# Altium schematic sheet pa.SchDoc: mcHF Pro Transceiver RF board
size A3; Author: Krassi Atanassov; CompanyName: MØNKA; Engineer: For radio amateurs experimentation, non-commercial use only. Thank you!; Revision: 0.8.2; SheetTotal: 14
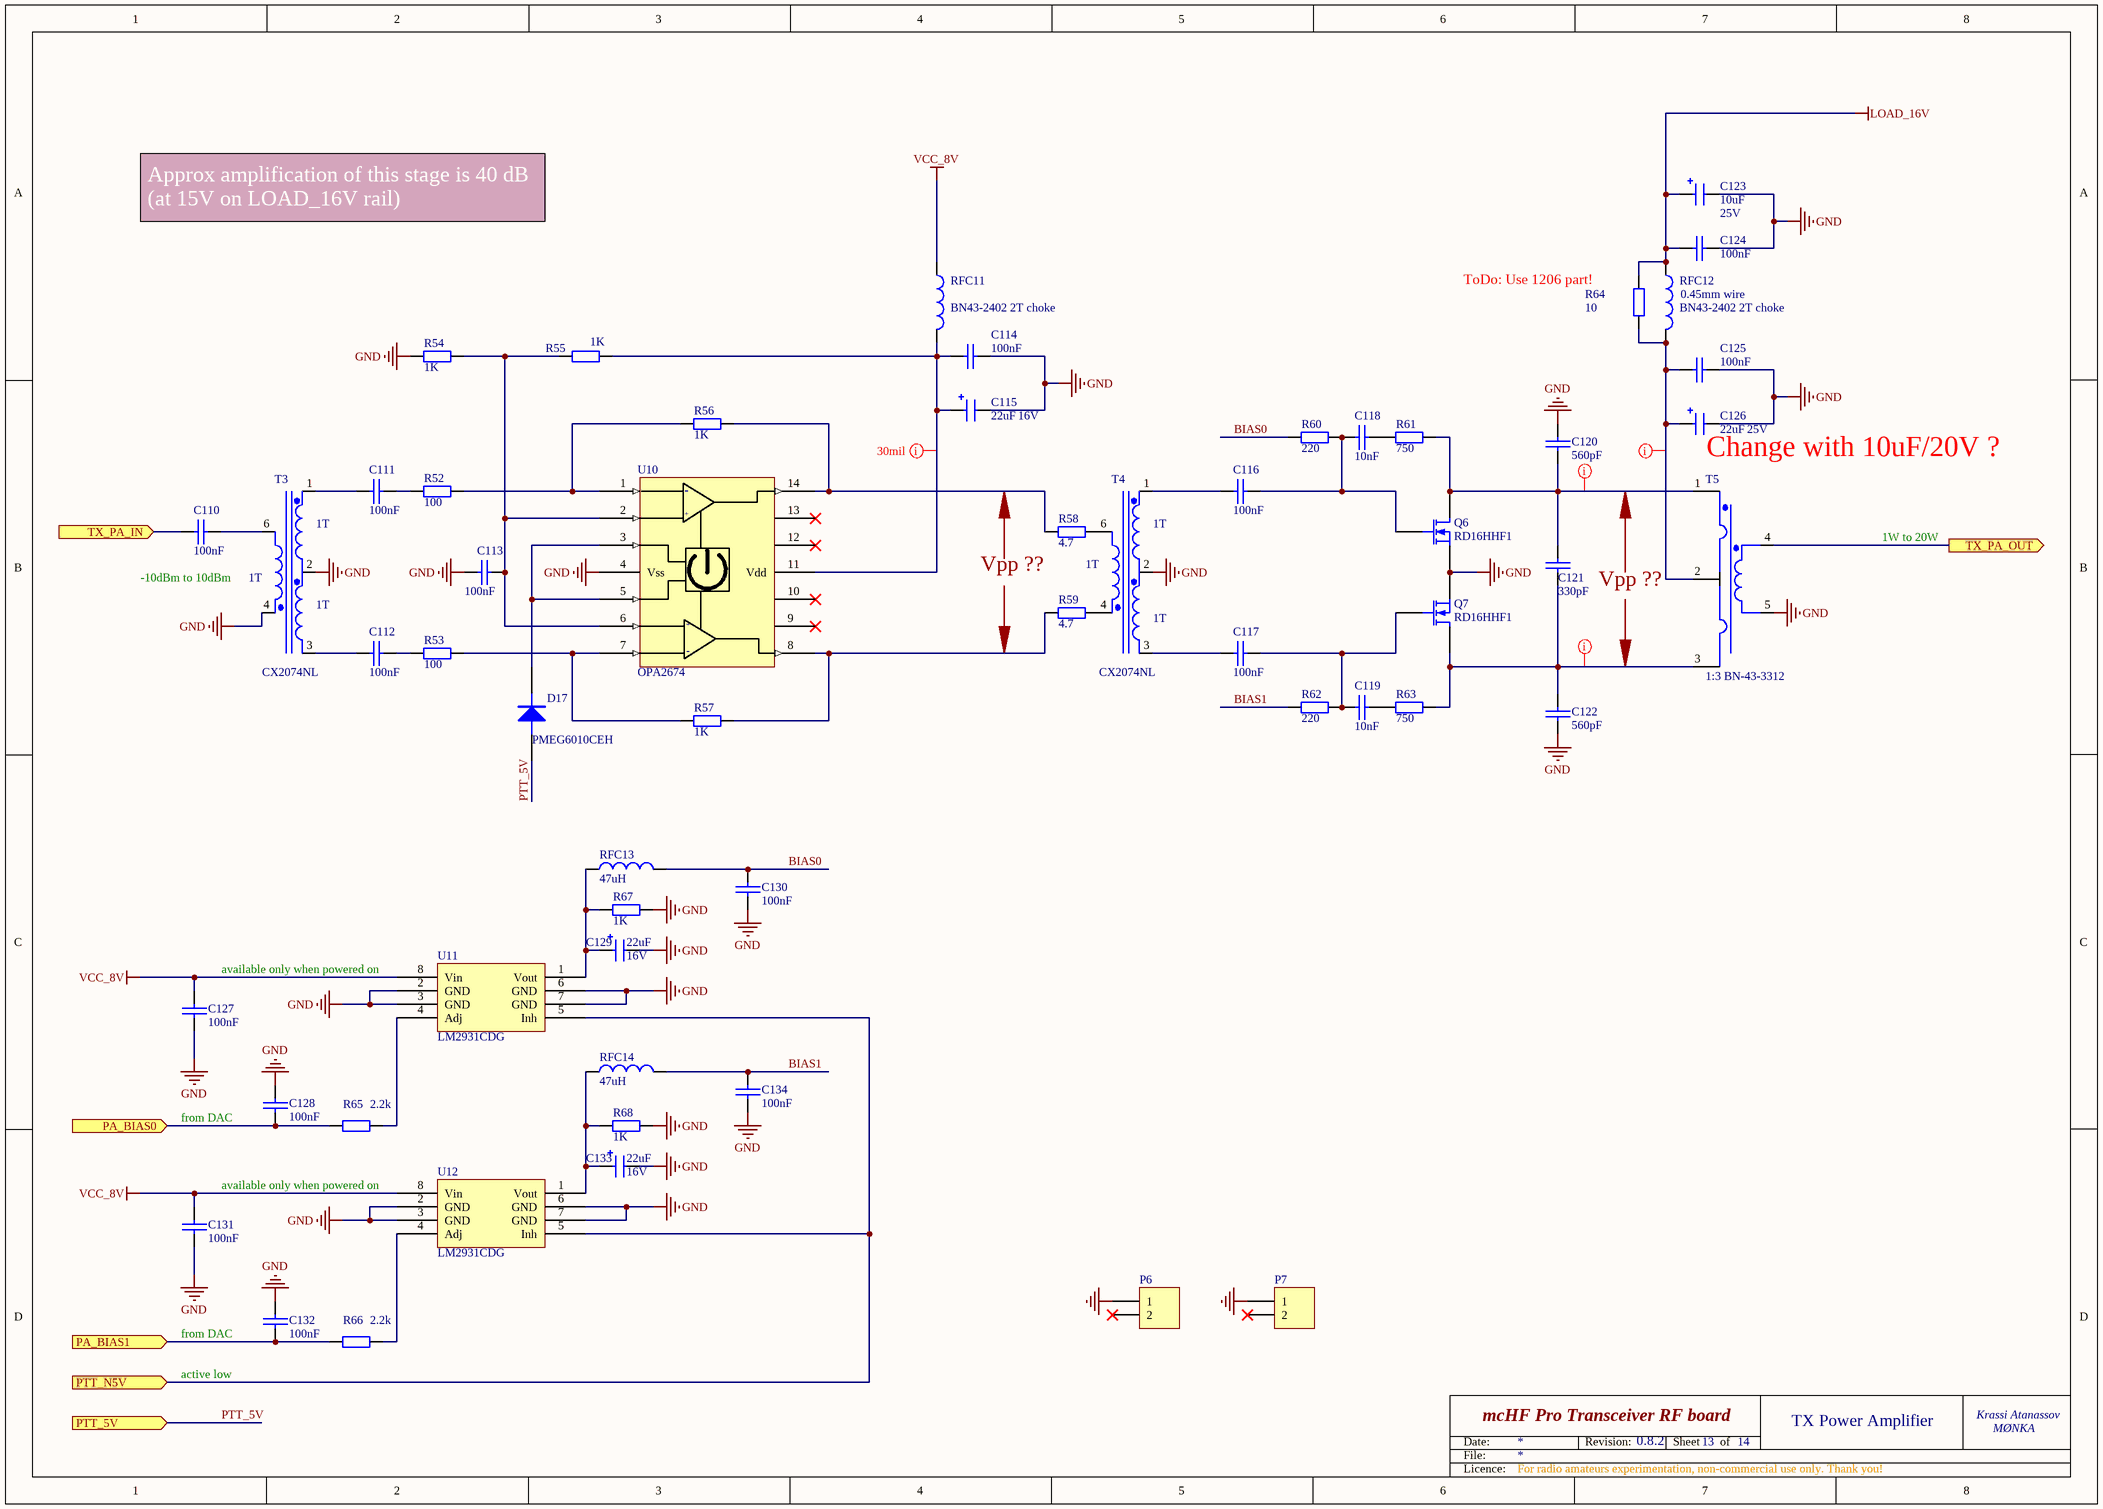
[diagram p0: pa.SchDoc]

## Parts
C110  100nF  [0805]
C111  100nF  [0805]
C112  100nF  [0805]
C113  100nF  [0805]
C114  100nF  [0805]
C115  22uF  Voltage: 16V  [1206_Elec_Cap]
C116  100nF  [0805]
C117  100nF  [0805]
C118  10nF  [0805]
C119  10nF  [0805]
C120  560pF  [0805]
C121  330pF  [0805]
C122  560pF  [0805]
C123  10uF  Voltage: 25V  [1206_Elec_Cap]
C124  100nF  [0805]
C125  100nF  [0805]
C126  22uF  Voltage: 25V  [1206_Elec_Cap]
C127  100nF  [0805]
C128  100nF  [0805]
C129  22uF  Voltage: 16V  [1206_Elec_Cap]
C130  100nF  [0805]
C131  100nF  [0805]
C132  100nF  [0805]
C133  22uF  Voltage: 16V  [1206_Elec_Cap]
C134  100nF  [0805]
D17  PMEG6010CEH  [SOD87]
P6  Header 2  [SIP2]  (value not drawn)
P7  Header 2  [SIP2]  (value not drawn)
Q6  RD16HHF1  [TO-220RF_flat]
Q7  RD16HHF1  [TO-220RF_flat]
R52  100  [0805]
R53  100  [0805]
R54  1K  [0805]
R55  1K  [0805]
R56  1K  [0805]
R57  1K  [0805]
R58  4.7  [0805]
R59  4.7  [0805]
R60  220  [0805]
R61  750  [0805]
R62  220  [0805]
R63  750  [0805]
R64  10  [0805]
R65  2.2k  [0805]
R66  2.2k  [0805]
R67  1K  [0805]
R68  1K  [0805]
RFC11  BN43-2402 2T choke  [F_Bead]
RFC12  BN43-2402 2T choke  [F_Bead]
RFC13  47uH  [0805]
RFC14  47uH  [0805]
T3  CX2074NL  [SOP5_NEW1]
T4  CX2074NL  [SOP5_NEW1]
T5  1:3 BN-43-3312  [PA_OUT_TRM]
U10  OPA2674  [SO-14-PRO]
U11  LM2931CDG  [SO-8-PRO]
U12  LM2931CDG  [SO-8-PRO]

## Ports
PA_BIAS0 (in), PA_BIAS1 (in), PTT_5V (in), PTT_N5V (in), TX_PA_IN (in), TX_PA_OUT (out)

## Nets
GND: C113.1 C114.1 C115.2 C120.1 C122.2 C123.2 C124.1 C125.1 C126.2 C127.2 C128.2 C129.2 C130.1 C131.2 C132.1 C133.2 C134.1 P6.1 P7.1 Q6.2(S) Q7.2(S) R54.1 R67.1 R68.1 T3.2(SecCmn) T3.4(Pri-) T4.2(SecCmn) T5.5(Sec-) U10.4(Vss) U11.2(GND) U11.3(GND) U11.6(GND) U11.7(GND) U12.2(GND) U12.3(GND) U12.6(GND) U12.7(GND)
LOAD_16V: C123.1 C124.2 R64.2 RFC12.1
VCC_8V: C127.1 C131.1 RFC11.1 U11.8(Vin) U12.8(Vin)
BIAS0: C130.2 R60.2 RFC13.2
BIAS1: C134.2 R62.2 RFC14.2
PA_BIAS0: C128.1 R65.1 ; port PA_BIAS0
PA_BIAS1: C132.2 R66.1 ; port PA_BIAS1
PTT_5V: D17.1(A) ; port PTT_5V
PTT_N5V: U11.5(Inh) U12.5(Inh) ; port PTT_N5V
TX_PA_IN: C110.2 ; port TX_PA_IN
TX_PA_OUT: T5.4(Sec+) ; port TX_PA_OUT
NetC110_1: C110.1 T3.6(Pri+)
NetC111_1: C111.1 T3.1(Sec0)
NetC111_2: C111.2 R52.2
NetC112_1: C112.1 T3.3(Sec180)
NetC112_2: C112.2 R53.2
NetC113_2: C113.2 R54.2 R55.2 U10.2 U10.6
NetC114_2: C114.2 C115.1 R55.1 RFC11.2 U10.11(Vdd)
NetC116_1: C116.1 C118.1 Q6.1(G) R60.1
NetC116_2: C116.2 T4.1(Sec0)
NetC117_1: C117.1 C119.1 Q7.1(G) R62.1
NetC117_2: C117.2 T4.3(Sec180)
NetC118_2: C118.2 R61.2
NetC119_2: C119.2 R63.2
NetC120_2: C120.2 C121.1 Q6.3(D) R61.1 T5.1(Pri_0_deg)
NetC121_2: C121.2 C122.1 Q7.3(D) R63.1 T5.3(Pri_180_deg)
NetC125_2: C125.2 C126.1 R64.1 RFC12.2 T5.2(Pri_Common)
NetC129_1: C129.1 R67.2 RFC13.1 U11.1(Vout)
NetC133_1: C133.1 R68.2 RFC14.1 U12.1(Vout)
NetD17_2: D17.2(K) U10.3 U10.5
NetR52_1: R52.1 R56.2 U10.1
NetR53_1: R53.1 R57.2 U10.7
NetR56_1: R56.1 R58.2 U10.14
NetR57_1: R57.1 R59.2 U10.8
NetR58_1: R58.1 T4.6(Pri+)
NetR59_1: R59.1 T4.4(Pri-)
NetR65_2: R65.2 U11.4(Adj)
NetR66_2: R66.2 U12.4(Adj)

Not connected (* = marked no-connect by the designer): P6 2*; P7 2*; U10 9* 10* 12* 13*

## Layout directives
rule Width Constraint [Pref Width = 50mil    Min Width = 50mil    Max Width = 50mil]: NetC120_2, NetC121_2
rule Width Constraint [Pref Width = 30mil    Min Width = 30mil    Max Width = 30mil]: NetC114_2
rule Width Constraint [Pref Width = 80mil    Min Width = 80mil    Max Width = 80mil]: NetC125_2

## Notes on the sheet
- Approx amplification of this stage is 40 dB  (at 15V on LOAD_16V rail)
- (near R64) ToDo: Use 1206 part!
- (near RFC12) 0.45mm wire
- (near C126) Change with 10uF/20V ?
- -10dBm to 10dBm
- (near T3) 1T
- Vpp ??
- (near T4) 1T
- 1W to 20W
- available only when powered on
- (near C128) from DAC
- (near C132) active low
- (near C132) from DAC
- 13
- TX Power Amplifier
- Date:
- File:
- Revision:
- Sheet
- of
- Licence:
- (in symbol OPA2674) -; +

## Library data of the parts
C110 C128 C132 = CAP: Capacitor; QT Order: QCC-00154; Price: 0.068
C111-C114 C116-C122 C124 C125 C127 C130 C131 C134 = CAP: Capacitor; Voltage: 100V; QT Order: QCC-00154; Price: 0.068
C115 C126 C129 C133 = CAP-POL: Electrolitic capacitor; QT Order: QCC-00202; Price: 0.235
C123 = CAP-POL: Electrolitic capacitor; QT Order: QCC-00166; Price: 0.204
D17 = PMEG6010CEH: DIODE, SCHOTTKY, 1A, 60V, SOD-123F; QT Order: QCD-00034; Price: 0.085
P6 P7 = Header 2: Header, 2-Pin
Q6 Q7 = RD16HHF1: Silicon RF Power MOS FET; Price: 7.375
R52 R53 R60-R63 = RES: Resistor; QT Order: QCR-00309; Price: 0.007
R54-R59 R67 R68 = RES: Resistor; QT Order: QCR-00579; Price: 0.061
R64 = RES: Resistor; QT Order: QCR-00279; Price: 0.013
R65 R66 = RES: Resistor; QT Order: QCR-00333; Price: 0.046
RFC11 RFC12 = FER_BEAD: BN43-2402 1t choke; Notes: post assembly; Price: 0.298
RFC13 RFC14 = TDK-NLV25T: INDUCTOR, SIGNAL LINE, 4.7UH, 1005; Price: 0.166
T3 T4 = CX2074NL: Transformer 4:1; Price: 0.298
T5 = PA_OUT_TR: 1:3 BN-43-3312 transformer; Notes: post assembly; Price: 0.534
U10 = OPA2674: Dual Wideband, High Output Current / Operational Amplifier with Current Limit; Price: 0.38
U11 U12 = LM2931CDG: 100 mA, Adjustable Output,  LDO Voltage Regulator with  60 V Load Dump Protection; Price: 0.39